# Altium project NONG LANH VER 1.0 .PrjPCB
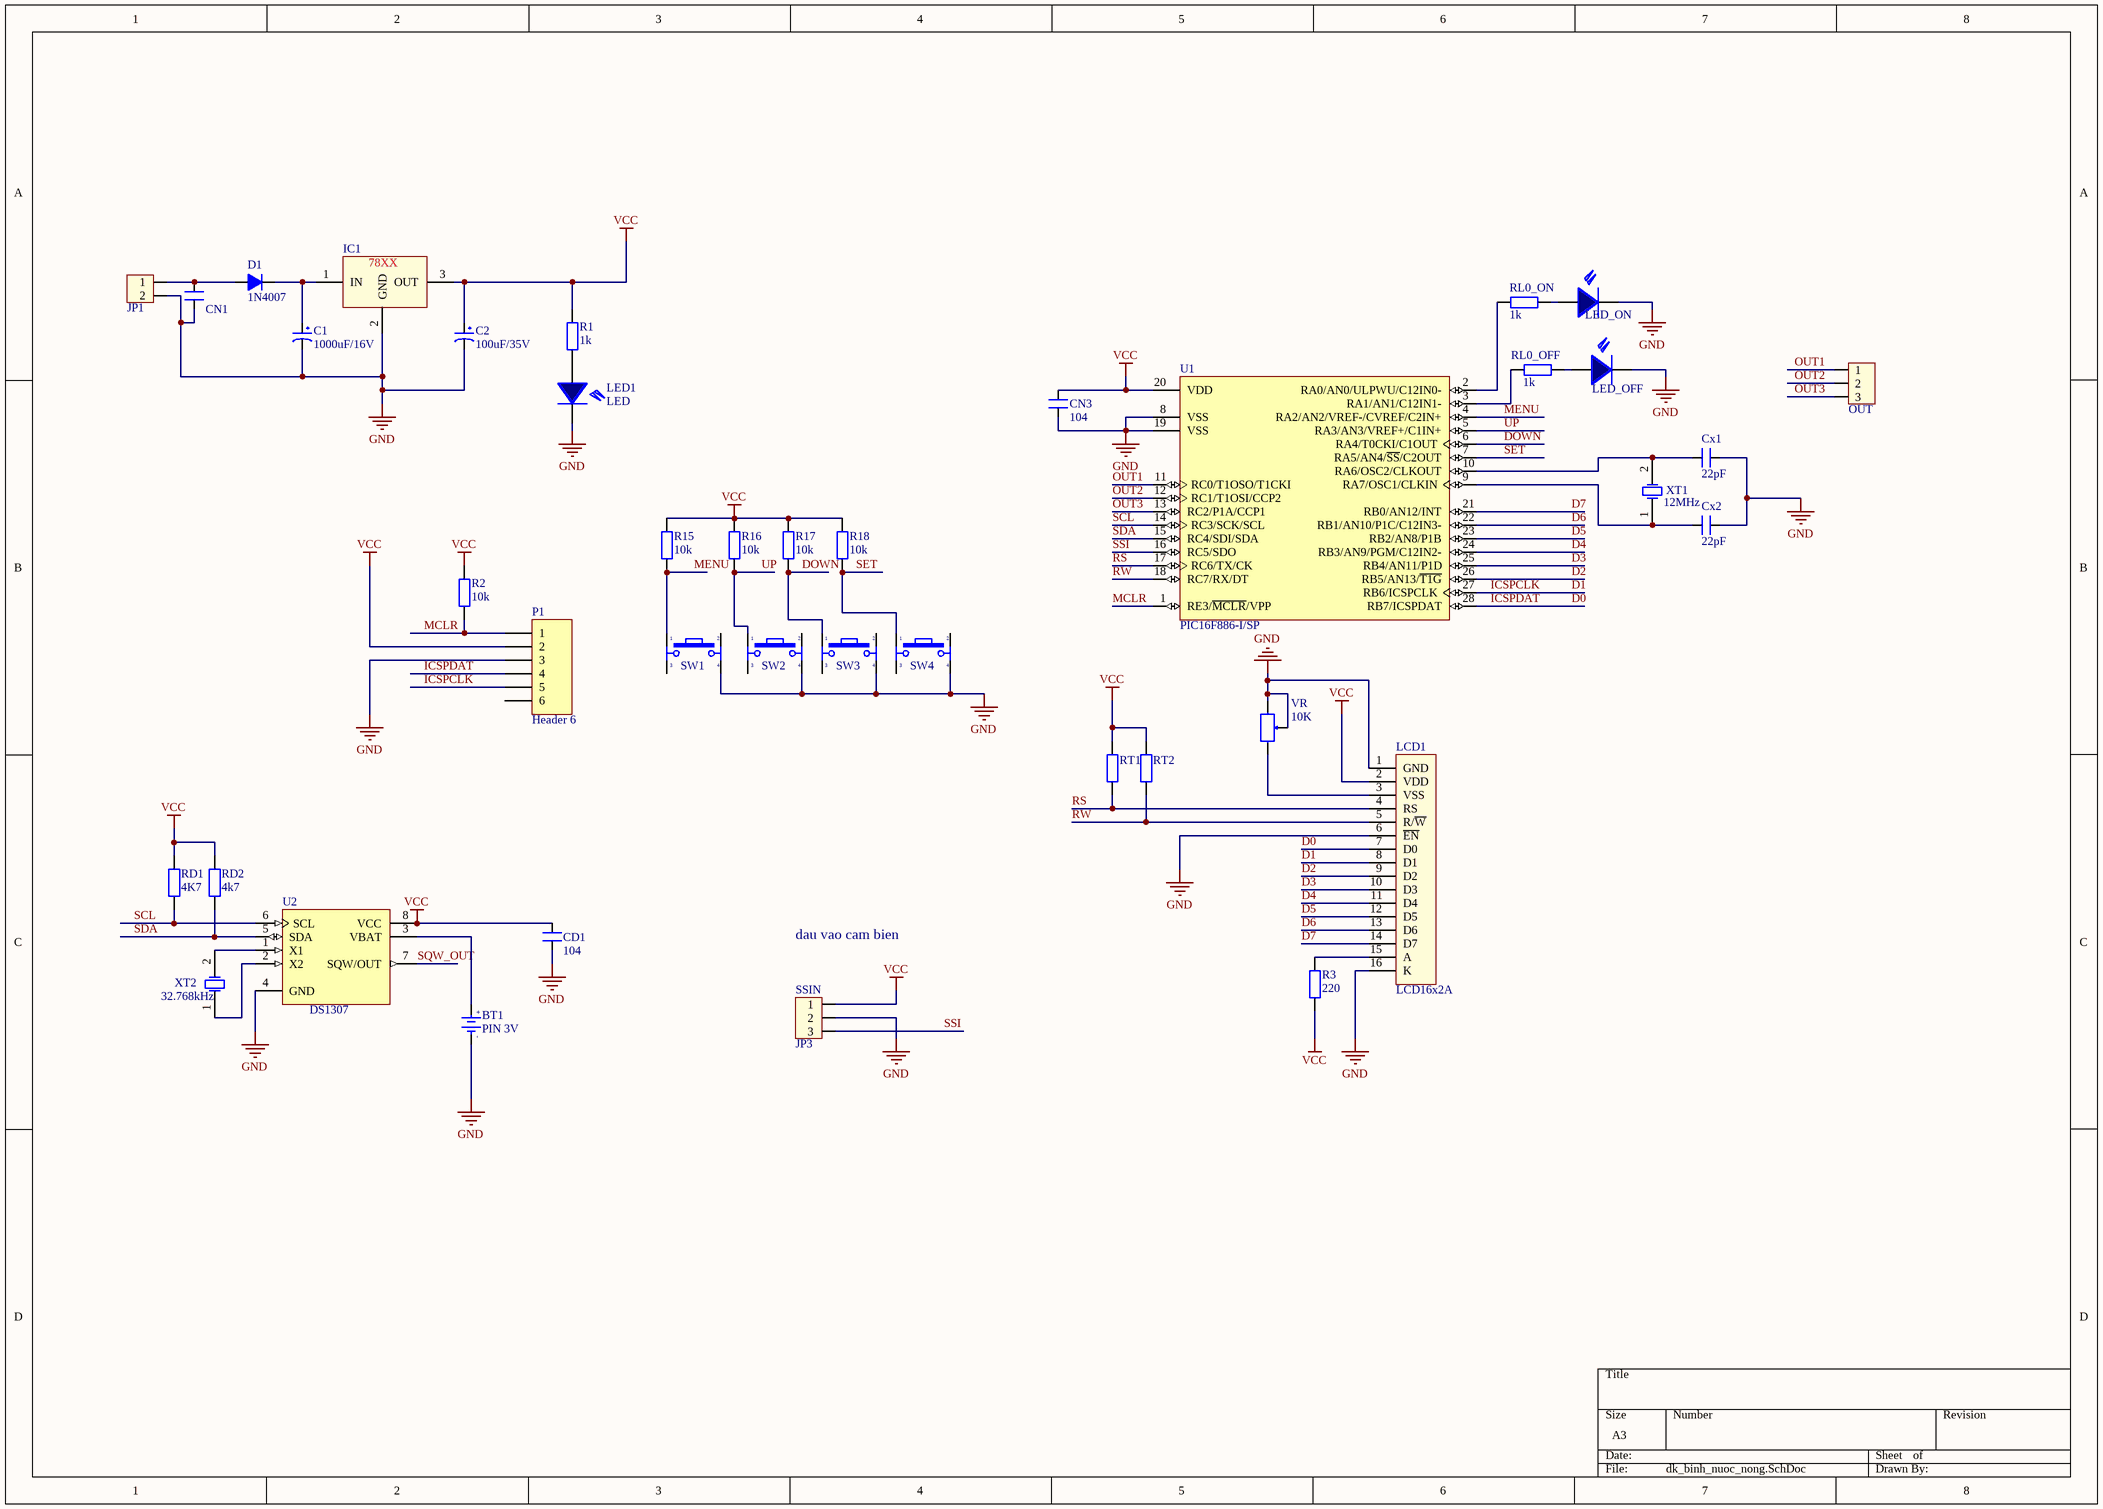
[diagram p0: dk_binh_nuoc_nong.SchDoc]
1 sheet, 40 parts. Net scope: global (net labels, ports and power ports of the same name join across sheets).
Board file: PCB1 VER 1.0 .PcbDoc

## Sheet dk_binh_nuoc_nong.SchDoc
size A3

### Parts
BT1  PIN 3V  [PIN3V]
C1  1000uF/16V  [CP1.5/3.4]
C2  100uF/35V  [CP1.5/3.4]
CD1  104  [CN2]
CN1  104  [CN1]  (value not drawn)
CN3  104  [CN1]
Cx1  22pF  [CN1]
Cx2  22pF  [CN1]
D1  1N4007  [D1A]
IC1  78xx  [QTO-220]  (value not drawn)
JP1  JP2  [CON2]  (value not drawn)
LCD1  LCD16x2A  [LCD16X2]
LED1  LED  [LED-3]
LED_OFF  LED  [LED-3]  (value not drawn)
LED_ON  LED  [LED-3]  (value not drawn)
OUT  JP3  [CON3]  (value not drawn)
P1  Header 6  [HED6]
R1  1k  [R1/4W]
R2  10k  [R1/4W]
R3  220  [R1/4W]
R15  10k  [R1/4W]
R16  10k  [R1/4W]
R17  10k  [R1/4W]
R18  10k  [R1/4W]
RD1  4K7  [R1/4W]
RD2  4k7  [R1/4W]
RL0_OFF  1k  [R1/4W]
RL0_ON  1k  [R1/4W]
RT1  10K  [R1/4W]  (value not drawn)
RT2  10K  [R1/4W]  (value not drawn)
SSIN  JP3  [CON3]
SW1  SW  [SW4]  (value not drawn)
SW2  SW  [SW4]  (value not drawn)
SW3  SW  [SW4]  (value not drawn)
SW4  SW  [SW4]  (value not drawn)
U1  PIC16F886-I/SP  [DIP28/W0.3]
U2  DS1307  [DIP8/W0.3]
VR  10K  [VR]
XT1  12MHz  [XT2]
XT2  32.768kHz  [XT32k]

### Nets
GND: BT1.2(GND) C1.2 C2.2 CD1.1 CN1.1 CN3.1 Cx1.2 Cx2.2 IC1.2(GND) JP1.2 LCD1.1(GND) LCD1.6(~{EN}) LCD1.16(K) LED1.2 LED_OFF.2 LED_ON.2 P1.3 SSIN.2 SW1.4 SW2.4 SW3.4 SW4.4 U1.8(VSS) U1.19(VSS) U2.4(GND) VR.1 VR.2
VCC: C2.1 CD1.2 CN3.2 IC1.3(OUT) LCD1.2(VDD) P1.2 R1.2 R2.2 R3.1 R15.2 R16.2 R17.2 R18.2 RD1.2 RD2.2 RT1.2 RT2.2 SSIN.1 U1.20(VDD) U2.8(VCC)
D0: LCD1.7(D0) P1.4 U1.28(RB7/ICSPDAT)  [also labelled ICSPDAT]
D1: LCD1.8(D1) P1.5 U1.27(RB6/ICSPCLK)  [also labelled ICSPCLK]
D2: LCD1.9(D2) U1.26(RB5/AN13/~{T1G})
D3: LCD1.10(D3) U1.25(RB4/AN11/P1D)
D4: LCD1.11(D4) U1.24(RB3/AN9/PGM/C12IN2-)
D5: LCD1.12(D5) U1.23(RB2/AN8/P1B)
D6: LCD1.13(D6) U1.22(RB1/AN10/P1C/C12IN3-)
D7: LCD1.14(D7) U1.21(RB0/AN12/INT)
DOWN: R17.1 SW3.1 U1.6(RA4/T0CKI/C1OUT)
MCLR: P1.1 R2.1 U1.1(RE3/~{MCLR}/VPP)
MENU: R15.1 SW1.1 U1.4(RA2/AN2/VREF-/CVREF/C2IN+)
OUT1: OUT.1 U1.11(RC0/T1OSO/T1CKI)
OUT2: OUT.2 U1.12(RC1/T1OSI/CCP2)
OUT3: OUT.3 U1.13(RC2/P1A/CCP1)
RS: LCD1.4(RS) RT1.1 U1.17(RC6/TX/CK)
RW: LCD1.5(R/~{W}) RT2.1 U1.18(RC7/RX/DT)
SCL: RD1.1 U1.14(RC3/SCK/SCL) U2.6(SCL)
SDA: RD2.1 U1.15(RC4/SDI/SDA) U2.5(SDA)
SET: R18.1 SW4.1 U1.7(RA5/AN4/~{SS}/C2OUT)
SQW_OUT: U2.7(SQW/OUT)
SSI: SSIN.3 U1.16(RC5/SDO)
UP: R16.1 SW2.1 U1.5(RA3/AN3/VREF+/C1IN+)
NetBT1_1: BT1.1(+3V) U2.3(VBAT)
NetC1_1: C1.1 D1.2(K) IC1.1(IN)
NetCN1_2: CN1.2 D1.1(A) JP1.1
NetCx1_1: Cx1.1 U1.10(RA6/OSC2/CLKOUT) XT1.2(OSC2)
NetCx2_1: Cx2.1 U1.9(RA7/OSC1/CLKIN) XT1.1(OSC1)
NetLCD1_3: LCD1.3(VSS) VR.3
NetLCD1_15: LCD1.15(A) R3.2
NetLED1_1: LED1.1 R1.1
NetLED_OFF_1: LED_OFF.1 RL0_OFF.1
NetLED_ON_1: LED_ON.1 RL0_ON.1
NetRL0_OFF_2: RL0_OFF.2 U1.3(RA1/AN1/C12IN1-)
NetRL0_ON_2: RL0_ON.2 U1.2(RA0/AN0/ULPWU/C12IN0-)
NetU2_1: U2.1(X1) XT2.2(OSC2)
NetU2_2: U2.2(X2) XT2.1(OSC1)

Not connected (* = marked no-connect by the designer): P1 6; SW1 2 3; SW2 2 3; SW3 2 3; SW4 2 3

### Notes on the sheet
- dau vao cam bien
- (in symbol 78xx) 78XX
- (in symbol PIN 3V) +; -
- (in symbol Res) 10K

### Library data of the parts
BT1 = PIN 3V: Battery 3VDC; Value: PIN 3V
C1 = CP4: Cap 1000uF/16V - 220uF/50V; Description 5: 4,7uF>10uF/250V_3,3uF>10uF/400V - 2,2uF>4,7uF/450V; Description 1: 2200uF-3300uF/6,3V - 1000uF-2200uF/10V; Description 2: 1000uF/16V - 470uF => 1000uF/25V - 100uF/100V; Description 3: 330uF>470uF/35V_220uF>470uF/50V_10uF>22uF/250V; Description 4: 220uF => 330uF/63V - 10uF =>33uF/160 - 200V; Value: 1000uF/16V
C2 = CP3: Cap 100uF/35V - 470uF/16V; Value: 100uF/35V/50V; Description 1: 1000uF/6,3V - 470uF/16V - 330uF - 25V; Description 2: 220uF/35V - 100uF/50V - 63V - 4,7uF/200V; Description 3: 22uF => 33uF100V - 3,3uF => 4,7uF/250V; Description 4: 2,2uF =>3,3uF/350 - 2,2uF/400V - 1uF/450V
CD1 CN1 CN3 = CN2: Cap np 104 => 105pF; Value: 0.1uF; Description: Cap np Cremic Value  104pF => 105pF
Cx1 Cx2 = CN0: Cremic For Xtal 1pF => 100pF; Value: 33pF; Description: Cap np Cremic value 1pF => 100pF
D1 = D1A: Diode 1A; Value: 1N4007
JP1 = Con2: Connector 2; Value: Connector 2
LCD1 = LCD16x2: LCD dipslay 16 char, 2 line; Value: LCD16x2A
LED1 LED_OFF LED_ON = LED: LED Single colour Green and Red; Value: LED 3 ly Single Colour; Description: LED 5 ly Single Colour; Description: Led  Vuong
OUT SSIN = Con3: Connector 3; Value: Connector 3
P1 = Header 6: Header, 6-Pin; LatestRevisionDate: 17-Jul-2002; LatestRevisionNote: Re-released for DXP Platform.; Publisher: Altium Limited
R1-R3 R15-R18 RD1 RD2 RL0_OFF RL0_ON RT1 RT2 = R1/4W: Resistor 1/4W; Value: R1/4W - 1K
SW1-SW4 = SW4: Switch button 4 pin; Value: Button chip 4 pin
U1 = PIC16F886-I/SP: Flash-Based, 8-Bit CMOS Microcontroller with nanoWatt Technology, 8K (x14-Bit words) Program Memory, 624 Bytes Data Memory, 24 I/O pins, 28-Pin SPDIP, Standard VDD Range, Industrial Temperature; FirstPublished: 29-Jan-2009; LatestRevisionDate: 02-Dec-2009; LatestRevisionNote: Updated datasheet to version revF, Apr-2009.; DatasheetVersion: revF, Apr-2009; PackageVersion: revBB, Aug-2009; PackageReference: SPDIP300-SP28; Publisher: Altium Limited; PackageDescription: 28-Lead Skinny Plastic Dual In-Line (SP) - 300 mil Body [SPDIP]; Supplier 1: Digi-Key; Supplier Part Number 1: PIC16F886-I/SP-ND; Supplier 2: Farnell; Supplier Part Number 2: 1439539; Supplier 3: Newark; Supplier Part Number 3: 74K8577; ComponentLink1Description: Datasheet; ComponentLink1URL: http://ww1.microchip.com/downloads/en/DeviceDoc/41291F.pdf; ComponentLink2Description: Packaging Specification; ComponentLink2URL: http://www.microchip.com/stellent/groups/techpub_sg/documents/packagingspec/en012702.pdf; ComponentLink3Description: Microchip.com Home; ComponentLink3URL: http://www.microchip.com/
U2 = DS1307: 64 X 8 Serial Real-Time Clock; Published: 13-Oct-2000; LatestRevisionDate: 06-Jun-2005; LatestRevisionNote: Stylized 3D Model Added.; DatasheetVersion: 10-Aug-1999; PackageVersion: 1999; PackageReference: DIP8; Publisher: Altium Limited; PackageDescription: DIP; 8 Leads; Row Spacing 7.62 mm; Pitch 2.54 mm; ComponentLink1Description: Manufacturer Link; ComponentLink1URL: http://www.maxim-ic.com/; ComponentLink2Description: Datasheet; ComponentLink2URL: http://pdfserv.maxim-ic.com/en/ds/DS1307.pdf; ComponentLink3Description: Discontinuation Notice; ComponentLink3URL: http://www.maxim-ic.com/qa/pdfs/non-obsolescence-letter.pdf
VR = VR: Var Resistor; Value: VR 10K
XT1 XT2 = XTAL: Crystal Oscillator; Published: 8-Jun-2000; LatestRevisionDate: 17-Jul-2002; LatestRevisionNote: Re-released for DXP Platform.; PackageReference: R38; Publisher: Altium Limited